# Altium project FPGA_Library_Check.PrjPcb
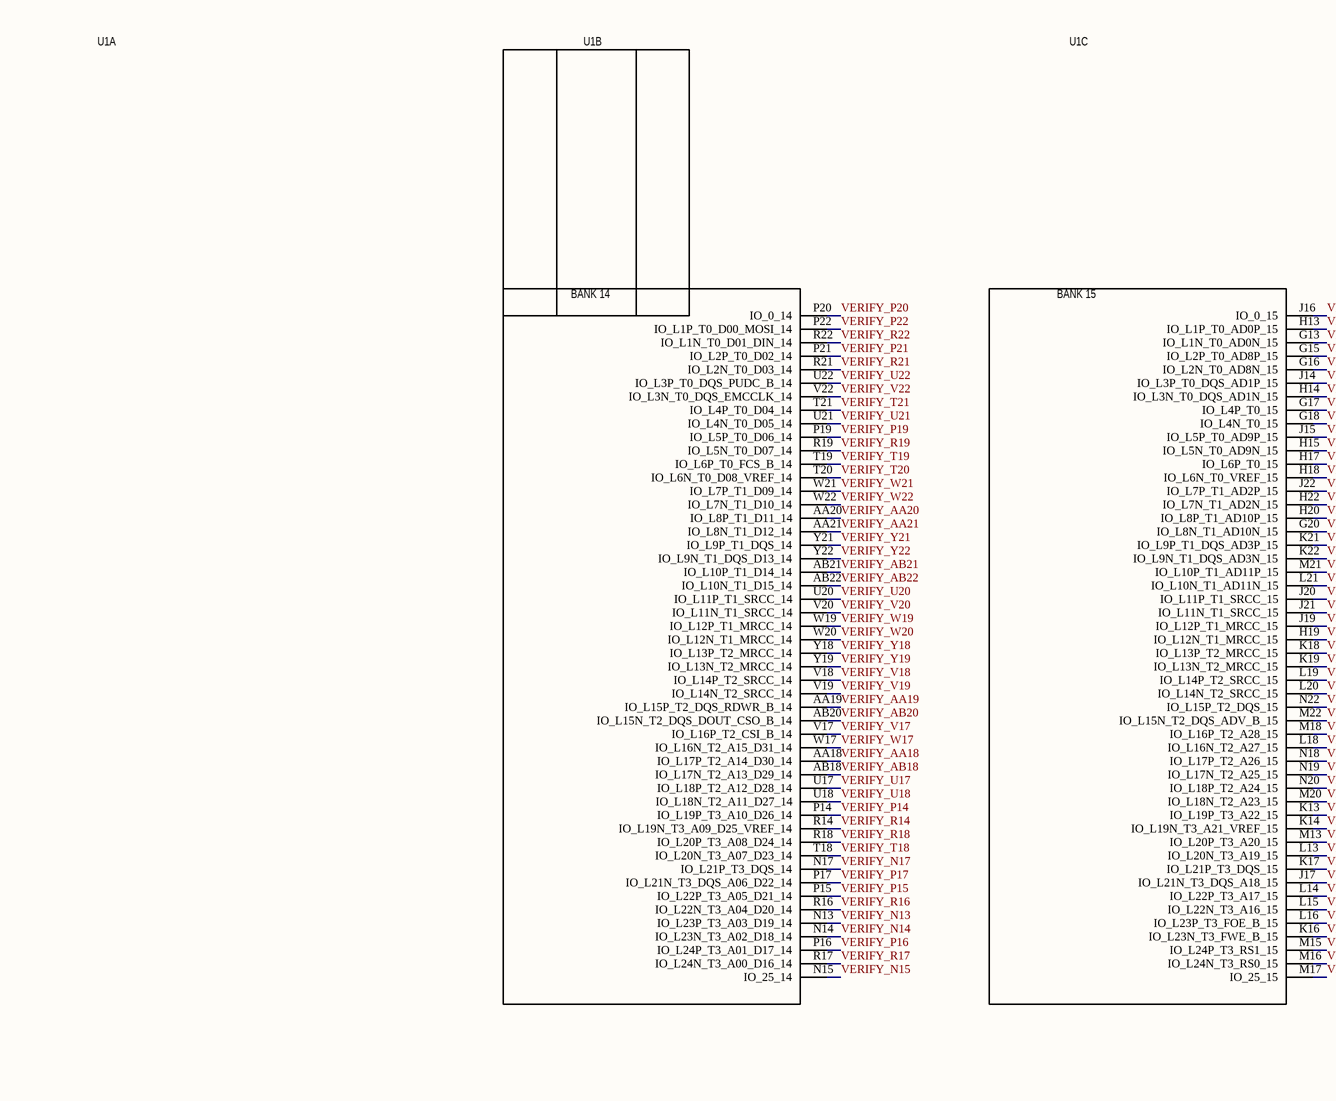
[diagram p0: FPGA_Library_Check.SchDoc, top left]
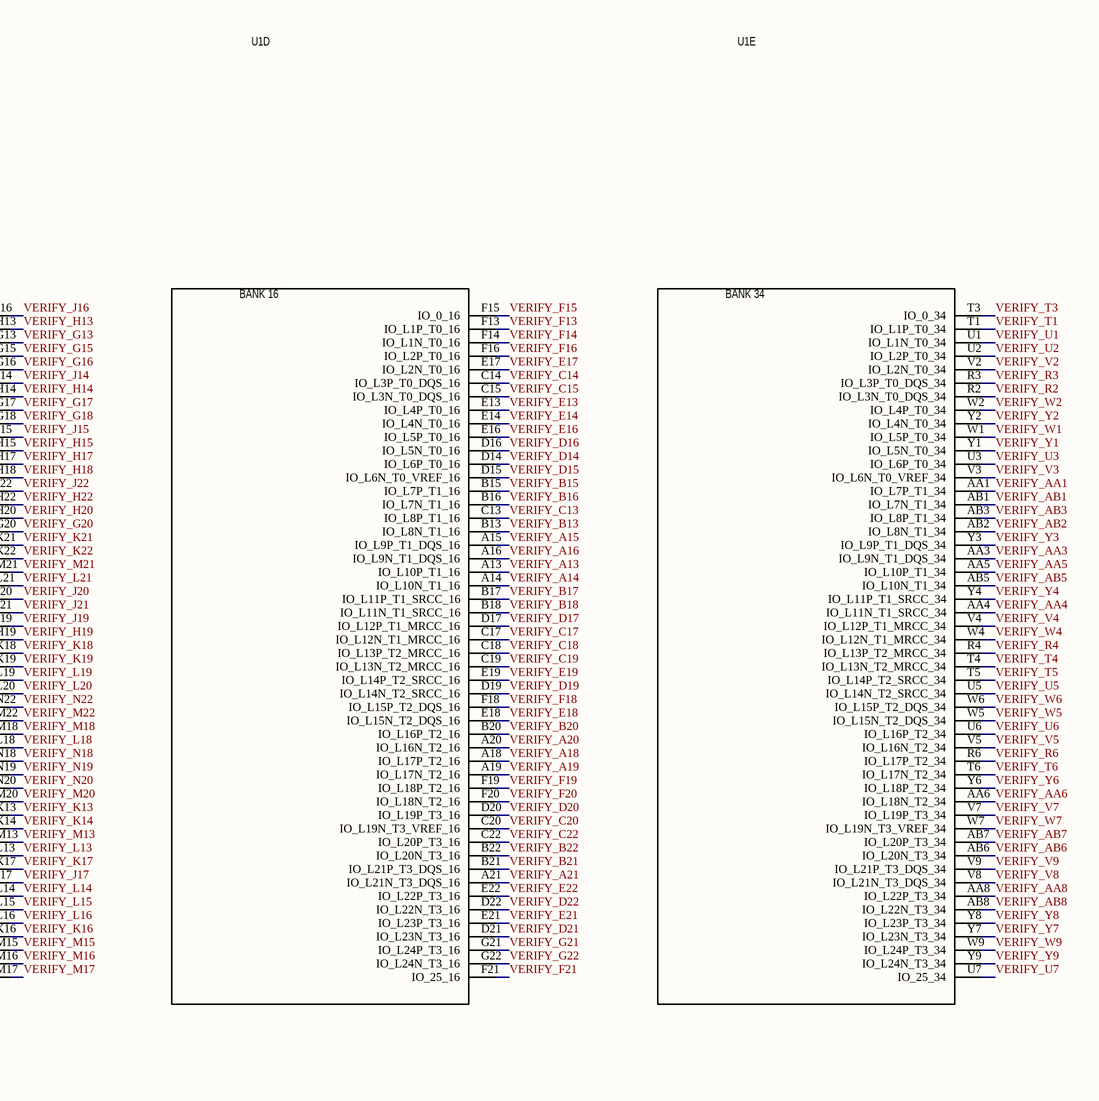
[diagram p1: FPGA_Library_Check.SchDoc, top right]
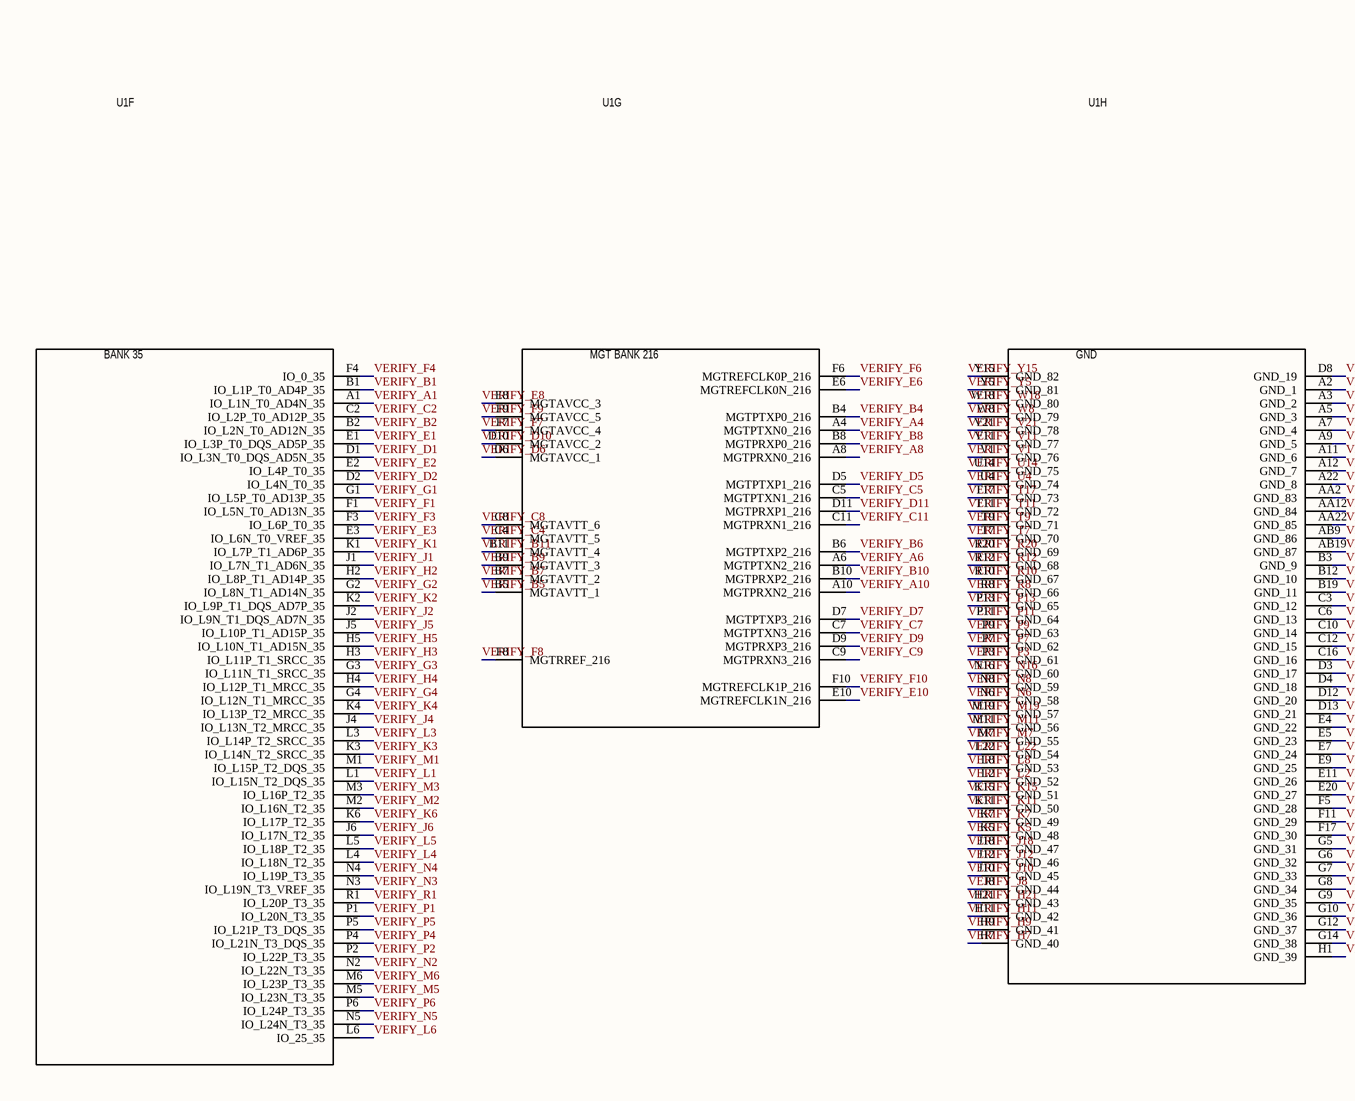
[diagram p2: FPGA_Library_Check.SchDoc, bottom left]
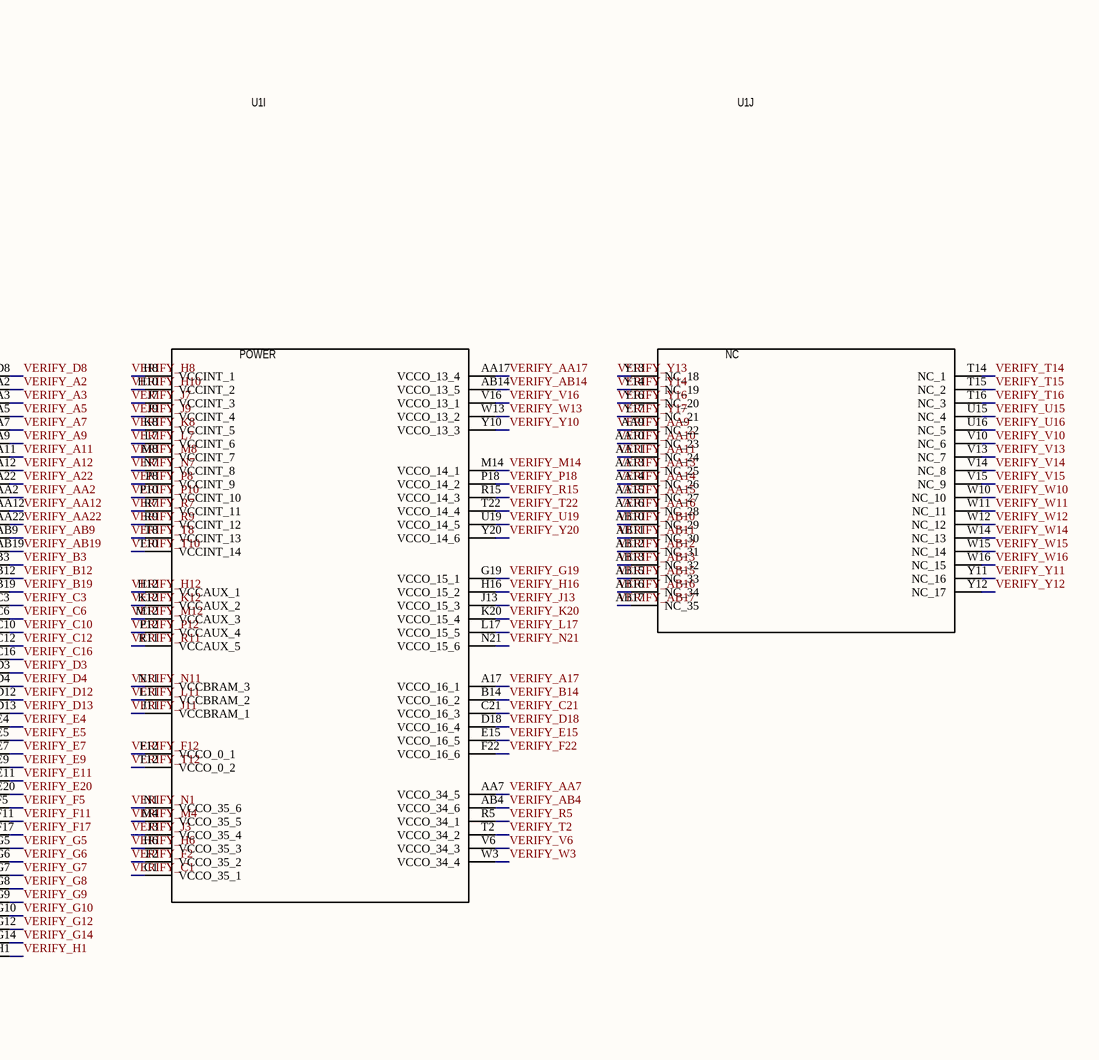
[diagram p3: FPGA_Library_Check.SchDoc, bottom right]
1 sheet, 1 parts. Net scope: global (net labels, ports and power ports of the same name join across sheets).

## Sheet FPGA_Library_Check.SchDoc
size 482 x 482 mm

### Parts
U1  XC7A50T-2FGG484I  [BGA484C100P22X22_2300X2300X260]  (value not drawn)  (parts A,B,C,D,E,F,G,H,I,J of 10)

### Nets
VERIFY_A1: U1.A1(IO_L1N_T0_AD4N_35)
VERIFY_A2: U1.A2(GND_1)
VERIFY_A3: U1.A3(GND_2)
VERIFY_A4: U1.A4(MGTPTXN0_216)
VERIFY_A5: U1.A5(GND_3)
VERIFY_A6: U1.A6(MGTPTXN2_216)
VERIFY_A7: U1.A7(GND_4)
VERIFY_A8: U1.A8(MGTPRXN0_216)
VERIFY_A9: U1.A9(GND_5)
VERIFY_A10: U1.A10(MGTPRXN2_216)
VERIFY_A11: U1.A11(GND_6)
VERIFY_A12: U1.A12(GND_7)
VERIFY_A13: U1.A13(IO_L10P_T1_16)
VERIFY_A14: U1.A14(IO_L10N_T1_16)
VERIFY_A15: U1.A15(IO_L9P_T1_DQS_16)
VERIFY_A16: U1.A16(IO_L9N_T1_DQS_16)
VERIFY_A17: U1.A17(VCCO_16_1)
VERIFY_A18: U1.A18(IO_L17P_T2_16)
VERIFY_A19: U1.A19(IO_L17N_T2_16)
VERIFY_A20: U1.A20(IO_L16N_T2_16)
VERIFY_A21: U1.A21(IO_L21N_T3_DQS_16)
VERIFY_A22: U1.A22(GND_8)
VERIFY_AA1: U1.AA1(IO_L7P_T1_34)
VERIFY_AA2: U1.AA2(GND_83)
VERIFY_AA3: U1.AA3(IO_L9N_T1_DQS_34)
VERIFY_AA4: U1.AA4(IO_L11N_T1_SRCC_34)
VERIFY_AA5: U1.AA5(IO_L10P_T1_34)
VERIFY_AA6: U1.AA6(IO_L18N_T2_34)
VERIFY_AA7: U1.AA7(VCCO_34_5)
VERIFY_AA8: U1.AA8(IO_L22P_T3_34)
VERIFY_AA9: U1.AA9(NC_22)
VERIFY_AA10: U1.AA10(NC_23)
VERIFY_AA11: U1.AA11(NC_24)
VERIFY_AA12: U1.AA12(GND_84)
VERIFY_AA13: U1.AA13(NC_25)
VERIFY_AA14: U1.AA14(NC_26)
VERIFY_AA15: U1.AA15(NC_27)
VERIFY_AA16: U1.AA16(NC_28)
VERIFY_AA17: U1.AA17(VCCO_13_4)
VERIFY_AA18: U1.AA18(IO_L17P_T2_A14_D30_14)
VERIFY_AA19: U1.AA19(IO_L15P_T2_DQS_RDWR_B_14)
VERIFY_AA20: U1.AA20(IO_L8P_T1_D11_14)
VERIFY_AA21: U1.AA21(IO_L8N_T1_D12_14)
VERIFY_AA22: U1.AA22(GND_85)
VERIFY_AB1: U1.AB1(IO_L7N_T1_34)
VERIFY_AB2: U1.AB2(IO_L8N_T1_34)
VERIFY_AB3: U1.AB3(IO_L8P_T1_34)
VERIFY_AB4: U1.AB4(VCCO_34_6)
VERIFY_AB5: U1.AB5(IO_L10N_T1_34)
VERIFY_AB6: U1.AB6(IO_L20N_T3_34)
VERIFY_AB7: U1.AB7(IO_L20P_T3_34)
VERIFY_AB8: U1.AB8(IO_L22N_T3_34)
VERIFY_AB9: U1.AB9(GND_86)
VERIFY_AB10: U1.AB10(NC_29)
VERIFY_AB11: U1.AB11(NC_30)
VERIFY_AB12: U1.AB12(NC_31)
VERIFY_AB13: U1.AB13(NC_32)
VERIFY_AB14: U1.AB14(VCCO_13_5)
VERIFY_AB15: U1.AB15(NC_33)
VERIFY_AB16: U1.AB16(NC_34)
VERIFY_AB17: U1.AB17(NC_35)
VERIFY_AB18: U1.AB18(IO_L17N_T2_A13_D29_14)
VERIFY_AB19: U1.AB19(GND_87)
VERIFY_AB20: U1.AB20(IO_L15N_T2_DQS_DOUT_CSO_B_14)
VERIFY_AB21: U1.AB21(IO_L10P_T1_D14_14)
VERIFY_AB22: U1.AB22(IO_L10N_T1_D15_14)
VERIFY_B1: U1.B1(IO_L1P_T0_AD4P_35)
VERIFY_B2: U1.B2(IO_L2N_T0_AD12N_35)
VERIFY_B3: U1.B3(GND_9)
VERIFY_B4: U1.B4(MGTPTXP0_216)
VERIFY_B5: U1.B5(MGTAVTT_1)
VERIFY_B6: U1.B6(MGTPTXP2_216)
VERIFY_B7: U1.B7(MGTAVTT_2)
VERIFY_B8: U1.B8(MGTPRXP0_216)
VERIFY_B9: U1.B9(MGTAVTT_3)
VERIFY_B10: U1.B10(MGTPRXP2_216)
VERIFY_B11: U1.B11(MGTAVTT_4)
VERIFY_B12: U1.B12(GND_10)
VERIFY_B13: U1.B13(IO_L8N_T1_16)
VERIFY_B14: U1.B14(VCCO_16_2)
VERIFY_B15: U1.B15(IO_L7P_T1_16)
VERIFY_B16: U1.B16(IO_L7N_T1_16)
VERIFY_B17: U1.B17(IO_L11P_T1_SRCC_16)
VERIFY_B18: U1.B18(IO_L11N_T1_SRCC_16)
VERIFY_B19: U1.B19(GND_11)
VERIFY_B20: U1.B20(IO_L16P_T2_16)
VERIFY_B21: U1.B21(IO_L21P_T3_DQS_16)
VERIFY_B22: U1.B22(IO_L20N_T3_16)
VERIFY_C1: U1.C1(VCCO_35_1)
VERIFY_C2: U1.C2(IO_L2P_T0_AD12P_35)
VERIFY_C3: U1.C3(GND_12)
VERIFY_C4: U1.C4(MGTAVTT_5)
VERIFY_C5: U1.C5(MGTPTXN1_216)
VERIFY_C6: U1.C6(GND_13)
VERIFY_C7: U1.C7(MGTPTXN3_216)
VERIFY_C8: U1.C8(MGTAVTT_6)
VERIFY_C9: U1.C9(MGTPRXN3_216)
VERIFY_C10: U1.C10(GND_14)
VERIFY_C11: U1.C11(MGTPRXN1_216)
VERIFY_C12: U1.C12(GND_15)
VERIFY_C13: U1.C13(IO_L8P_T1_16)
VERIFY_C14: U1.C14(IO_L3P_T0_DQS_16)
VERIFY_C15: U1.C15(IO_L3N_T0_DQS_16)
VERIFY_C16: U1.C16(GND_16)
VERIFY_C17: U1.C17(IO_L12N_T1_MRCC_16)
VERIFY_C18: U1.C18(IO_L13P_T2_MRCC_16)
VERIFY_C19: U1.C19(IO_L13N_T2_MRCC_16)
VERIFY_C20: U1.C20(IO_L19N_T3_VREF_16)
VERIFY_C21: U1.C21(VCCO_16_3)
VERIFY_C22: U1.C22(IO_L20P_T3_16)
VERIFY_D1: U1.D1(IO_L3N_T0_DQS_AD5N_35)
VERIFY_D2: U1.D2(IO_L4N_T0_35)
VERIFY_D3: U1.D3(GND_17)
VERIFY_D4: U1.D4(GND_18)
VERIFY_D5: U1.D5(MGTPTXP1_216)
VERIFY_D6: U1.D6(MGTAVCC_1)
VERIFY_D7: U1.D7(MGTPTXP3_216)
VERIFY_D8: U1.D8(GND_19)
VERIFY_D9: U1.D9(MGTPRXP3_216)
VERIFY_D10: U1.D10(MGTAVCC_2)
VERIFY_D11: U1.D11(MGTPRXP1_216)
VERIFY_D12: U1.D12(GND_20)
VERIFY_D13: U1.D13(GND_21)
VERIFY_D14: U1.D14(IO_L6P_T0_16)
VERIFY_D15: U1.D15(IO_L6N_T0_VREF_16)
VERIFY_D16: U1.D16(IO_L5N_T0_16)
VERIFY_D17: U1.D17(IO_L12P_T1_MRCC_16)
VERIFY_D18: U1.D18(VCCO_16_4)
VERIFY_D19: U1.D19(IO_L14N_T2_SRCC_16)
VERIFY_D20: U1.D20(IO_L19P_T3_16)
VERIFY_D21: U1.D21(IO_L23N_T3_16)
VERIFY_D22: U1.D22(IO_L22N_T3_16)
VERIFY_E1: U1.E1(IO_L3P_T0_DQS_AD5P_35)
VERIFY_E2: U1.E2(IO_L4P_T0_35)
VERIFY_E3: U1.E3(IO_L6N_T0_VREF_35)
VERIFY_E4: U1.E4(GND_22)
VERIFY_E5: U1.E5(GND_23)
VERIFY_E6: U1.E6(MGTREFCLK0N_216)
VERIFY_E7: U1.E7(GND_24)
VERIFY_E8: U1.E8(MGTAVCC_3)
VERIFY_E9: U1.E9(GND_25)
VERIFY_E10: U1.E10(MGTREFCLK1N_216)
VERIFY_E11: U1.E11(GND_26)
VERIFY_E13: U1.E13(IO_L4P_T0_16)
VERIFY_E14: U1.E14(IO_L4N_T0_16)
VERIFY_E15: U1.E15(VCCO_16_5)
VERIFY_E16: U1.E16(IO_L5P_T0_16)
VERIFY_E17: U1.E17(IO_L2N_T0_16)
VERIFY_E18: U1.E18(IO_L15N_T2_DQS_16)
VERIFY_E19: U1.E19(IO_L14P_T2_SRCC_16)
VERIFY_E20: U1.E20(GND_27)
VERIFY_E21: U1.E21(IO_L23P_T3_16)
VERIFY_E22: U1.E22(IO_L22P_T3_16)
VERIFY_F1: U1.F1(IO_L5N_T0_AD13N_35)
VERIFY_F2: U1.F2(VCCO_35_2)
VERIFY_F3: U1.F3(IO_L6P_T0_35)
VERIFY_F4: U1.F4(IO_0_35)
VERIFY_F5: U1.F5(GND_28)
VERIFY_F6: U1.F6(MGTREFCLK0P_216)
VERIFY_F7: U1.F7(MGTAVCC_4)
VERIFY_F8: U1.F8(MGTRREF_216)
VERIFY_F9: U1.F9(MGTAVCC_5)
VERIFY_F10: U1.F10(MGTREFCLK1P_216)
VERIFY_F11: U1.F11(GND_29)
VERIFY_F12: U1.F12(VCCO_0_1)
VERIFY_F13: U1.F13(IO_L1P_T0_16)
VERIFY_F14: U1.F14(IO_L1N_T0_16)
VERIFY_F15: U1.F15(IO_0_16)
VERIFY_F16: U1.F16(IO_L2P_T0_16)
VERIFY_F17: U1.F17(GND_30)
VERIFY_F18: U1.F18(IO_L15P_T2_DQS_16)
VERIFY_F19: U1.F19(IO_L18P_T2_16)
VERIFY_F20: U1.F20(IO_L18N_T2_16)
VERIFY_F21: U1.F21(IO_25_16)
VERIFY_F22: U1.F22(VCCO_16_6)
VERIFY_G1: U1.G1(IO_L5P_T0_AD13P_35)
VERIFY_G2: U1.G2(IO_L8N_T1_AD14N_35)
VERIFY_G3: U1.G3(IO_L11N_T1_SRCC_35)
VERIFY_G4: U1.G4(IO_L12N_T1_MRCC_35)
VERIFY_G5: U1.G5(GND_31)
VERIFY_G6: U1.G6(GND_32)
VERIFY_G7: U1.G7(GND_33)
VERIFY_G8: U1.G8(GND_34)
VERIFY_G9: U1.G9(GND_35)
VERIFY_G10: U1.G10(GND_36)
VERIFY_G12: U1.G12(GND_37)
VERIFY_G13: U1.G13(IO_L1N_T0_AD0N_15)
VERIFY_G14: U1.G14(GND_38)
VERIFY_G15: U1.G15(IO_L2P_T0_AD8P_15)
VERIFY_G16: U1.G16(IO_L2N_T0_AD8N_15)
VERIFY_G17: U1.G17(IO_L4P_T0_15)
VERIFY_G18: U1.G18(IO_L4N_T0_15)
VERIFY_G19: U1.G19(VCCO_15_1)
VERIFY_G20: U1.G20(IO_L8N_T1_AD10N_15)
VERIFY_G21: U1.G21(IO_L24P_T3_16)
VERIFY_G22: U1.G22(IO_L24N_T3_16)
VERIFY_H1: U1.H1(GND_39)
VERIFY_H2: U1.H2(IO_L8P_T1_AD14P_35)
VERIFY_H3: U1.H3(IO_L11P_T1_SRCC_35)
VERIFY_H4: U1.H4(IO_L12P_T1_MRCC_35)
VERIFY_H5: U1.H5(IO_L10N_T1_AD15N_35)
VERIFY_H6: U1.H6(VCCO_35_3)
VERIFY_H7: U1.H7(GND_40)
VERIFY_H8: U1.H8(VCCINT_1)
VERIFY_H9: U1.H9(GND_41)
VERIFY_H10: U1.H10(VCCINT_2)
VERIFY_H11: U1.H11(GND_42)
VERIFY_H12: U1.H12(VCCAUX_1)
VERIFY_H13: U1.H13(IO_L1P_T0_AD0P_15)
VERIFY_H14: U1.H14(IO_L3N_T0_DQS_AD1N_15)
VERIFY_H15: U1.H15(IO_L5N_T0_AD9N_15)
VERIFY_H16: U1.H16(VCCO_15_2)
VERIFY_H17: U1.H17(IO_L6P_T0_15)
VERIFY_H18: U1.H18(IO_L6N_T0_VREF_15)
VERIFY_H19: U1.H19(IO_L12N_T1_MRCC_15)
VERIFY_H20: U1.H20(IO_L8P_T1_AD10P_15)
VERIFY_H21: U1.H21(GND_43)
VERIFY_H22: U1.H22(IO_L7N_T1_AD2N_15)
VERIFY_J1: U1.J1(IO_L7N_T1_AD6N_35)
VERIFY_J2: U1.J2(IO_L9N_T1_DQS_AD7N_35)
VERIFY_J3: U1.J3(VCCO_35_4)
VERIFY_J4: U1.J4(IO_L13N_T2_MRCC_35)
VERIFY_J5: U1.J5(IO_L10P_T1_AD15P_35)
VERIFY_J6: U1.J6(IO_L17N_T2_35)
VERIFY_J7: U1.J7(VCCINT_3)
VERIFY_J8: U1.J8(GND_44)
VERIFY_J9: U1.J9(VCCINT_4)
VERIFY_J10: U1.J10(GND_45)
VERIFY_J11: U1.J11(VCCBRAM_1)
VERIFY_J12: U1.J12(GND_46)
VERIFY_J13: U1.J13(VCCO_15_3)
VERIFY_J14: U1.J14(IO_L3P_T0_DQS_AD1P_15)
VERIFY_J15: U1.J15(IO_L5P_T0_AD9P_15)
VERIFY_J16: U1.J16(IO_0_15)
VERIFY_J17: U1.J17(IO_L21N_T3_DQS_A18_15)
VERIFY_J18: U1.J18(GND_47)
VERIFY_J19: U1.J19(IO_L12P_T1_MRCC_15)
VERIFY_J20: U1.J20(IO_L11P_T1_SRCC_15)
VERIFY_J21: U1.J21(IO_L11N_T1_SRCC_15)
VERIFY_J22: U1.J22(IO_L7P_T1_AD2P_15)
VERIFY_K1: U1.K1(IO_L7P_T1_AD6P_35)
VERIFY_K2: U1.K2(IO_L9P_T1_DQS_AD7P_35)
VERIFY_K3: U1.K3(IO_L14N_T2_SRCC_35)
VERIFY_K4: U1.K4(IO_L13P_T2_MRCC_35)
VERIFY_K5: U1.K5(GND_48)
VERIFY_K6: U1.K6(IO_L17P_T2_35)
VERIFY_K7: U1.K7(GND_49)
VERIFY_K8: U1.K8(VCCINT_5)
VERIFY_K11: U1.K11(GND_50)
VERIFY_K12: U1.K12(VCCAUX_2)
VERIFY_K13: U1.K13(IO_L19P_T3_A22_15)
VERIFY_K14: U1.K14(IO_L19N_T3_A21_VREF_15)
VERIFY_K15: U1.K15(GND_51)
VERIFY_K16: U1.K16(IO_L23N_T3_FWE_B_15)
VERIFY_K17: U1.K17(IO_L21P_T3_DQS_15)
VERIFY_K18: U1.K18(IO_L13P_T2_MRCC_15)
VERIFY_K19: U1.K19(IO_L13N_T2_MRCC_15)
VERIFY_K20: U1.K20(VCCO_15_4)
VERIFY_K21: U1.K21(IO_L9P_T1_DQS_AD3P_15)
VERIFY_K22: U1.K22(IO_L9N_T1_DQS_AD3N_15)
VERIFY_L1: U1.L1(IO_L15N_T2_DQS_35)
VERIFY_L2: U1.L2(GND_52)
VERIFY_L3: U1.L3(IO_L14P_T2_SRCC_35)
VERIFY_L4: U1.L4(IO_L18N_T2_35)
VERIFY_L5: U1.L5(IO_L18P_T2_35)
VERIFY_L6: U1.L6(IO_25_35)
VERIFY_L7: U1.L7(VCCINT_6)
VERIFY_L8: U1.L8(GND_53)
VERIFY_L11: U1.L11(VCCBRAM_2)
VERIFY_L13: U1.L13(IO_L20N_T3_A19_15)
VERIFY_L14: U1.L14(IO_L22P_T3_A17_15)
VERIFY_L15: U1.L15(IO_L22N_T3_A16_15)
VERIFY_L16: U1.L16(IO_L23P_T3_FOE_B_15)
VERIFY_L17: U1.L17(VCCO_15_5)
VERIFY_L18: U1.L18(IO_L16N_T2_A27_15)
VERIFY_L19: U1.L19(IO_L14P_T2_SRCC_15)
VERIFY_L20: U1.L20(IO_L14N_T2_SRCC_15)
VERIFY_L21: U1.L21(IO_L10N_T1_AD11N_15)
VERIFY_L22: U1.L22(GND_54)
VERIFY_M1: U1.M1(IO_L15P_T2_DQS_35)
VERIFY_M2: U1.M2(IO_L16N_T2_35)
VERIFY_M3: U1.M3(IO_L16P_T2_35)
VERIFY_M4: U1.M4(VCCO_35_5)
VERIFY_M5: U1.M5(IO_L23N_T3_35)
VERIFY_M6: U1.M6(IO_L23P_T3_35)
VERIFY_M7: U1.M7(GND_55)
VERIFY_M8: U1.M8(VCCINT_7)
VERIFY_M11: U1.M11(GND_56)
VERIFY_M12: U1.M12(VCCAUX_3)
VERIFY_M13: U1.M13(IO_L20P_T3_A20_15)
VERIFY_M14: U1.M14(VCCO_14_1)
VERIFY_M15: U1.M15(IO_L24P_T3_RS1_15)
VERIFY_M16: U1.M16(IO_L24N_T3_RS0_15)
VERIFY_M17: U1.M17(IO_25_15)
VERIFY_M18: U1.M18(IO_L16P_T2_A28_15)
VERIFY_M19: U1.M19(GND_57)
VERIFY_M20: U1.M20(IO_L18N_T2_A23_15)
VERIFY_M21: U1.M21(IO_L10P_T1_AD11P_15)
VERIFY_M22: U1.M22(IO_L15N_T2_DQS_ADV_B_15)
VERIFY_N1: U1.N1(VCCO_35_6)
VERIFY_N2: U1.N2(IO_L22N_T3_35)
VERIFY_N3: U1.N3(IO_L19N_T3_VREF_35)
VERIFY_N4: U1.N4(IO_L19P_T3_35)
VERIFY_N5: U1.N5(IO_L24N_T3_35)
VERIFY_N6: U1.N6(GND_58)
VERIFY_N7: U1.N7(VCCINT_8)
VERIFY_N8: U1.N8(GND_59)
VERIFY_N11: U1.N11(VCCBRAM_3)
VERIFY_N13: U1.N13(IO_L23P_T3_A03_D19_14)
VERIFY_N14: U1.N14(IO_L23N_T3_A02_D18_14)
VERIFY_N15: U1.N15(IO_25_14)
VERIFY_N16: U1.N16(GND_60)
VERIFY_N17: U1.N17(IO_L21P_T3_DQS_14)
VERIFY_N18: U1.N18(IO_L17P_T2_A26_15)
VERIFY_N19: U1.N19(IO_L17N_T2_A25_15)
VERIFY_N20: U1.N20(IO_L18P_T2_A24_15)
VERIFY_N21: U1.N21(VCCO_15_6)
VERIFY_N22: U1.N22(IO_L15P_T2_DQS_15)
VERIFY_P1: U1.P1(IO_L20N_T3_35)
VERIFY_P2: U1.P2(IO_L22P_T3_35)
VERIFY_P3: U1.P3(GND_61)
VERIFY_P4: U1.P4(IO_L21N_T3_DQS_35)
VERIFY_P5: U1.P5(IO_L21P_T3_DQS_35)
VERIFY_P6: U1.P6(IO_L24P_T3_35)
VERIFY_P7: U1.P7(GND_62)
VERIFY_P8: U1.P8(VCCINT_9)
VERIFY_P9: U1.P9(GND_63)
VERIFY_P10: U1.P10(VCCINT_10)
VERIFY_P11: U1.P11(GND_64)
VERIFY_P12: U1.P12(VCCAUX_4)
VERIFY_P13: U1.P13(GND_65)
VERIFY_P14: U1.P14(IO_L19P_T3_A10_D26_14)
VERIFY_P15: U1.P15(IO_L22P_T3_A05_D21_14)
VERIFY_P16: U1.P16(IO_L24P_T3_A01_D17_14)
VERIFY_P17: U1.P17(IO_L21N_T3_DQS_A06_D22_14)
VERIFY_P18: U1.P18(VCCO_14_2)
VERIFY_P19: U1.P19(IO_L5P_T0_D06_14)
VERIFY_P20: U1.P20(IO_0_14)
VERIFY_P21: U1.P21(IO_L2P_T0_D02_14)
VERIFY_P22: U1.P22(IO_L1P_T0_D00_MOSI_14)
VERIFY_R1: U1.R1(IO_L20P_T3_35)
VERIFY_R2: U1.R2(IO_L3N_T0_DQS_34)
VERIFY_R3: U1.R3(IO_L3P_T0_DQS_34)
VERIFY_R4: U1.R4(IO_L13P_T2_MRCC_34)
VERIFY_R5: U1.R5(VCCO_34_1)
VERIFY_R6: U1.R6(IO_L17P_T2_34)
VERIFY_R7: U1.R7(VCCINT_11)
VERIFY_R8: U1.R8(GND_66)
VERIFY_R9: U1.R9(VCCINT_12)
VERIFY_R10: U1.R10(GND_67)
VERIFY_R11: U1.R11(VCCAUX_5)
VERIFY_R12: U1.R12(GND_68)
VERIFY_R14: U1.R14(IO_L19N_T3_A09_D25_VREF_14)
VERIFY_R15: U1.R15(VCCO_14_3)
VERIFY_R16: U1.R16(IO_L22N_T3_A04_D20_14)
VERIFY_R17: U1.R17(IO_L24N_T3_A00_D16_14)
VERIFY_R18: U1.R18(IO_L20P_T3_A08_D24_14)
VERIFY_R19: U1.R19(IO_L5N_T0_D07_14)
VERIFY_R20: U1.R20(GND_69)
VERIFY_R21: U1.R21(IO_L2N_T0_D03_14)
VERIFY_R22: U1.R22(IO_L1N_T0_D01_DIN_14)
VERIFY_T1: U1.T1(IO_L1P_T0_34)
VERIFY_T2: U1.T2(VCCO_34_2)
VERIFY_T3: U1.T3(IO_0_34)
VERIFY_T4: U1.T4(IO_L13N_T2_MRCC_34)
VERIFY_T5: U1.T5(IO_L14P_T2_SRCC_34)
VERIFY_T6: U1.T6(IO_L17N_T2_34)
VERIFY_T7: U1.T7(GND_70)
VERIFY_T8: U1.T8(VCCINT_13)
VERIFY_T9: U1.T9(GND_71)
VERIFY_T10: U1.T10(VCCINT_14)
VERIFY_T11: U1.T11(GND_72)
VERIFY_T12: U1.T12(VCCO_0_2)
VERIFY_T14: U1.T14(NC_1)
VERIFY_T15: U1.T15(NC_2)
VERIFY_T16: U1.T16(NC_3)
VERIFY_T17: U1.T17(GND_73)
VERIFY_T18: U1.T18(IO_L20N_T3_A07_D23_14)
VERIFY_T19: U1.T19(IO_L6P_T0_FCS_B_14)
VERIFY_T20: U1.T20(IO_L6N_T0_D08_VREF_14)
VERIFY_T21: U1.T21(IO_L4P_T0_D04_14)
VERIFY_T22: U1.T22(VCCO_14_4)
VERIFY_U1: U1.U1(IO_L1N_T0_34)
VERIFY_U2: U1.U2(IO_L2P_T0_34)
VERIFY_U3: U1.U3(IO_L6P_T0_34)
VERIFY_U4: U1.U4(GND_74)
VERIFY_U5: U1.U5(IO_L14N_T2_SRCC_34)
VERIFY_U6: U1.U6(IO_L16P_T2_34)
VERIFY_U7: U1.U7(IO_25_34)
VERIFY_U14: U1.U14(GND_75)
VERIFY_U15: U1.U15(NC_4)
VERIFY_U16: U1.U16(NC_5)
VERIFY_U17: U1.U17(IO_L18P_T2_A12_D28_14)
VERIFY_U18: U1.U18(IO_L18N_T2_A11_D27_14)
VERIFY_U19: U1.U19(VCCO_14_5)
VERIFY_U20: U1.U20(IO_L11P_T1_SRCC_14)
VERIFY_U21: U1.U21(IO_L4N_T0_D05_14)
VERIFY_U22: U1.U22(IO_L3P_T0_DQS_PUDC_B_14)
VERIFY_V1: U1.V1(GND_76)
VERIFY_V2: U1.V2(IO_L2N_T0_34)
VERIFY_V3: U1.V3(IO_L6N_T0_VREF_34)
VERIFY_V4: U1.V4(IO_L12P_T1_MRCC_34)
VERIFY_V5: U1.V5(IO_L16N_T2_34)
VERIFY_V6: U1.V6(VCCO_34_3)
VERIFY_V7: U1.V7(IO_L19P_T3_34)
VERIFY_V8: U1.V8(IO_L21N_T3_DQS_34)
VERIFY_V9: U1.V9(IO_L21P_T3_DQS_34)
VERIFY_V10: U1.V10(NC_6)
VERIFY_V11: U1.V11(GND_77)
VERIFY_V13: U1.V13(NC_7)
VERIFY_V14: U1.V14(NC_8)
VERIFY_V15: U1.V15(NC_9)
VERIFY_V16: U1.V16(VCCO_13_1)
VERIFY_V17: U1.V17(IO_L16P_T2_CSI_B_14)
VERIFY_V18: U1.V18(IO_L14P_T2_SRCC_14)
VERIFY_V19: U1.V19(IO_L14N_T2_SRCC_14)
VERIFY_V20: U1.V20(IO_L11N_T1_SRCC_14)
VERIFY_V21: U1.V21(GND_78)
VERIFY_V22: U1.V22(IO_L3N_T0_DQS_EMCCLK_14)
VERIFY_W1: U1.W1(IO_L5P_T0_34)
VERIFY_W2: U1.W2(IO_L4P_T0_34)
VERIFY_W3: U1.W3(VCCO_34_4)
VERIFY_W4: U1.W4(IO_L12N_T1_MRCC_34)
VERIFY_W5: U1.W5(IO_L15N_T2_DQS_34)
VERIFY_W6: U1.W6(IO_L15P_T2_DQS_34)
VERIFY_W7: U1.W7(IO_L19N_T3_VREF_34)
VERIFY_W8: U1.W8(GND_79)
VERIFY_W9: U1.W9(IO_L24P_T3_34)
VERIFY_W10: U1.W10(NC_10)
VERIFY_W11: U1.W11(NC_11)
VERIFY_W12: U1.W12(NC_12)
VERIFY_W13: U1.W13(VCCO_13_2)
VERIFY_W14: U1.W14(NC_13)
VERIFY_W15: U1.W15(NC_14)
VERIFY_W16: U1.W16(NC_15)
VERIFY_W17: U1.W17(IO_L16N_T2_A15_D31_14)
VERIFY_W18: U1.W18(GND_80)
VERIFY_W19: U1.W19(IO_L12P_T1_MRCC_14)
VERIFY_W20: U1.W20(IO_L12N_T1_MRCC_14)
VERIFY_W21: U1.W21(IO_L7P_T1_D09_14)
VERIFY_W22: U1.W22(IO_L7N_T1_D10_14)
VERIFY_Y1: U1.Y1(IO_L5N_T0_34)
VERIFY_Y2: U1.Y2(IO_L4N_T0_34)
VERIFY_Y3: U1.Y3(IO_L9P_T1_DQS_34)
VERIFY_Y4: U1.Y4(IO_L11P_T1_SRCC_34)
VERIFY_Y5: U1.Y5(GND_81)
VERIFY_Y6: U1.Y6(IO_L18P_T2_34)
VERIFY_Y7: U1.Y7(IO_L23N_T3_34)
VERIFY_Y8: U1.Y8(IO_L23P_T3_34)
VERIFY_Y9: U1.Y9(IO_L24N_T3_34)
VERIFY_Y10: U1.Y10(VCCO_13_3)
VERIFY_Y11: U1.Y11(NC_16)
VERIFY_Y12: U1.Y12(NC_17)
VERIFY_Y13: U1.Y13(NC_18)
VERIFY_Y14: U1.Y14(NC_19)
VERIFY_Y15: U1.Y15(GND_82)
VERIFY_Y16: U1.Y16(NC_20)
VERIFY_Y17: U1.Y17(NC_21)
VERIFY_Y18: U1.Y18(IO_L13P_T2_MRCC_14)
VERIFY_Y19: U1.Y19(IO_L13N_T2_MRCC_14)
VERIFY_Y20: U1.Y20(VCCO_14_6)
VERIFY_Y21: U1.Y21(IO_L9P_T1_DQS_14)
VERIFY_Y22: U1.Y22(IO_L9N_T1_DQS_D13_14)

### Notes on the sheet
- (in symbol XC7A50T-2FGG484I, part B) BANK 14
- (in symbol XC7A50T-2FGG484I, part C) BANK 15
- (in symbol XC7A50T-2FGG484I, part D) BANK 16
- (in symbol XC7A50T-2FGG484I, part E) BANK 34
- (in symbol XC7A50T-2FGG484I, part F) BANK 35
- (in symbol XC7A50T-2FGG484I, part G) MGT BANK 216
- (in symbol XC7A50T-2FGG484I, part H) GND
- (in symbol XC7A50T-2FGG484I, part I) POWER
- (in symbol XC7A50T-2FGG484I, part J) NC

### Library data of the parts
U1 = XC7A50T-2FGG484I: FPGA - Field Programmable Gate Array XC7A50T-2FGG484I; Manufacturer_Name: AMD; Geometry.Height: 2.6mm; Manufacturer_Part_Number: XC7A50T-2FGG484I; Mouser Part Number: 217-XC7A50T-2FGG484I; Mouser Price/Stock: https://www.mouser.co.uk/ProductDetail/Xilinx/XC7A50T-2FGG484I?qs=rrS6PyfT74djoRso%252BOe%2F9Q%3D%3D; Arrow Part Number: *; Arrow Price/Stock: *; Datasheet Link: https://www.xilinx.com/support/documentation/data_sheets/ds181_Artix_7_Data_Sheet.pdf